# EAGLE design cartePIC+PCR95.8% 3 via+res (EAGLE 9.6.2)
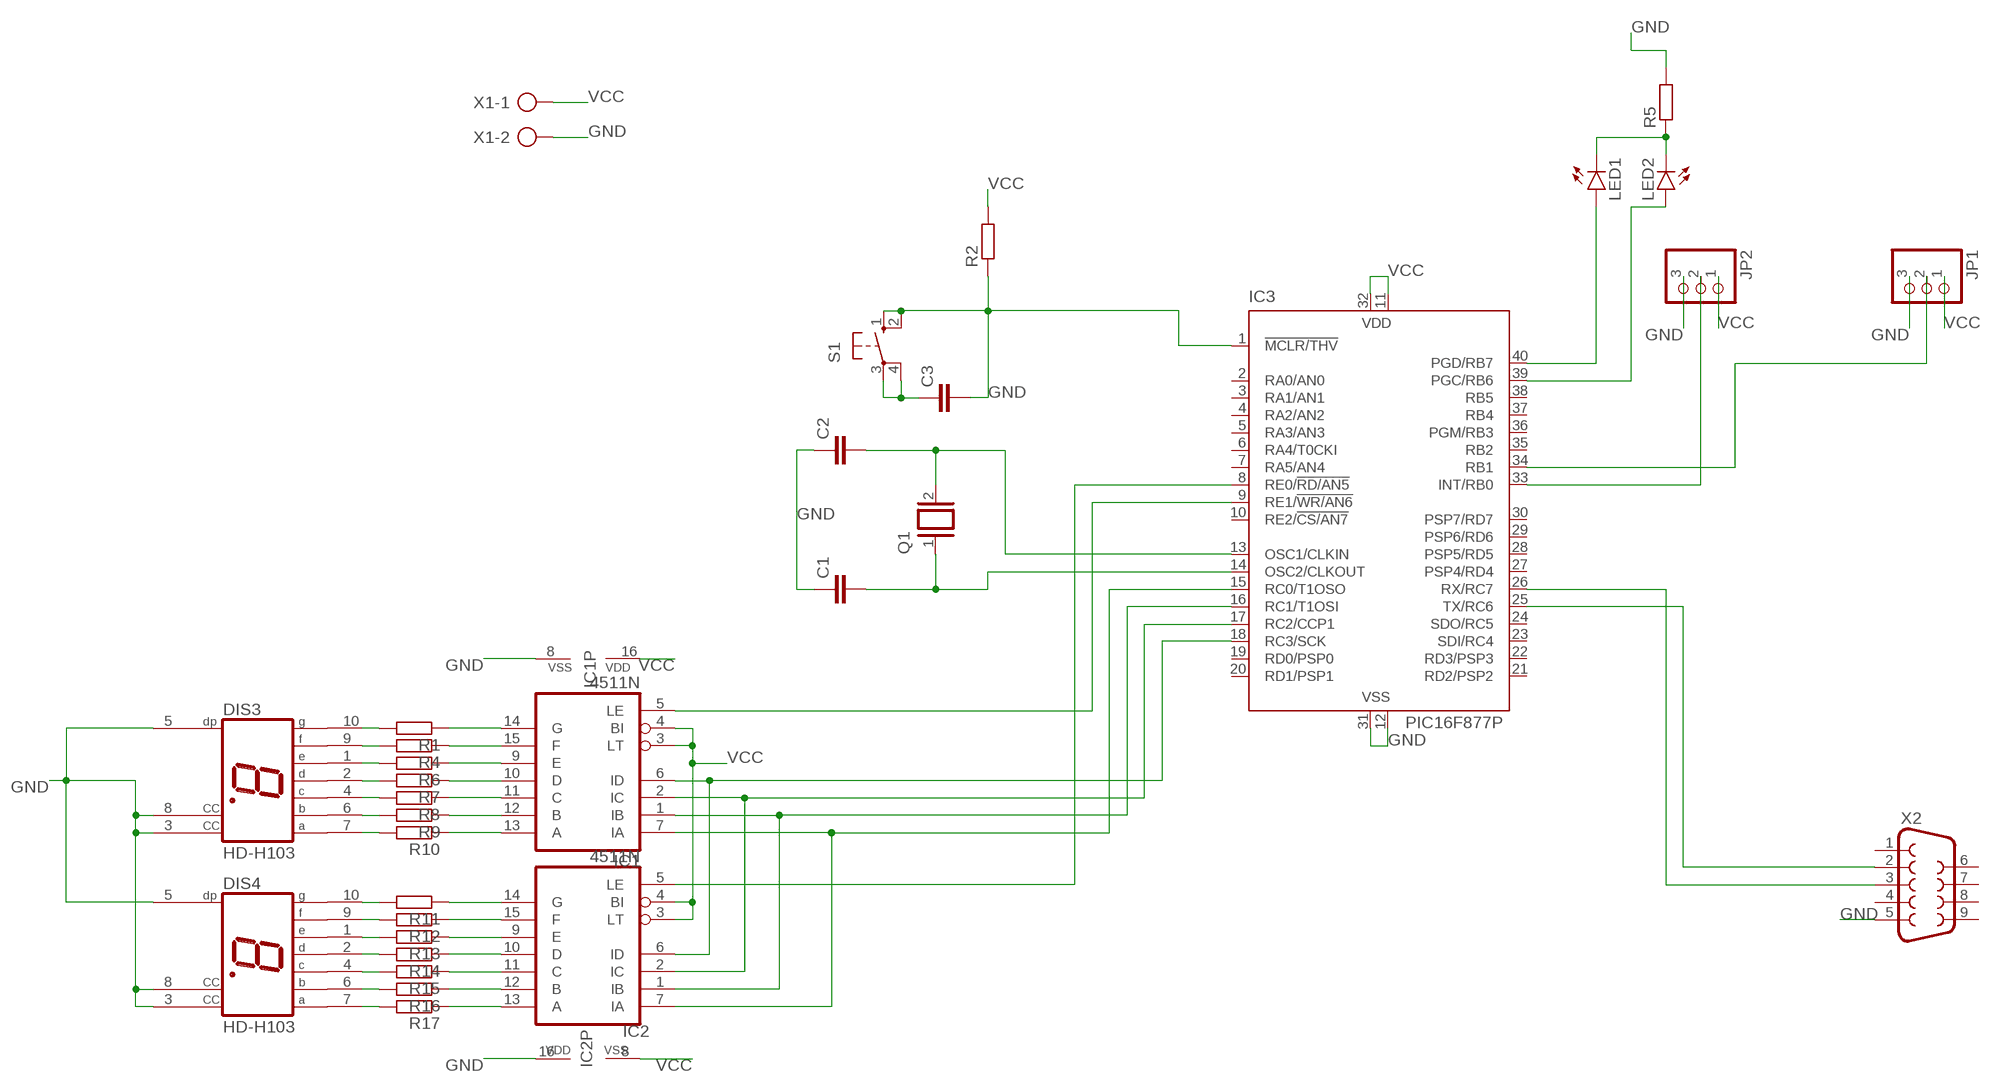
[diagram p0: schematic, sheet 1]

## Parts
C1  C-EU025-025X050  [C025-025X050]
C2  C-EU025-025X050  [C025-025X050]
C3  C-EU025-025X050  [C025-025X050]
DIS3  HD-H103  [HDSP-M]
DIS4  HD-H103  [HDSP-M]
IC1  4511N  [DIL16]
IC2  4511N  [DIL16]
IC3  PIC16F877P  [DIL40]
JP1  PINHD-1X3  [1X03]
JP2  PINHD-1X3  [1X03]
LED1  LED5MM  [LED5MM]
LED2  LED5MM  [LED5MM]
Q1  XTAL/S  [QS]
R1  R-EU_0207/10  [0207/10]
R2  R-EU_0207/10  [0207/10]
R4  R-EU_0207/10  [0207/10]
R5  R-EU_0207/10  [0207/10]
R6  R-EU_0207/10  [0207/10]
R7  R-EU_0207/10  [0207/10]
R8  R-EU_0207/10  [0207/10]
R9  R-EU_0207/10  [0207/10]
R10  R-EU_0207/10  [0207/10]
R11  R-EU_0207/10  [0207/10]
R12  R-EU_0207/10  [0207/10]
R13  R-EU_0207/10  [0207/10]
R14  R-EU_0207/10  [0207/10]
R15  R-EU_0207/10  [0207/10]
R16  R-EU_0207/10  [0207/10]
R17  R-EU_0207/10  [0207/10]
S1  10-XX  [B3F-10XX]
X1  AK300/2  [AK300/2]
X2  F09H  [F09H]

## Nets
GND: C1.1 C2.1 C3.2 DIS3.3(CC) DIS3.5(DP) DIS3.8(CC) DIS4.3(CC) DIS4.5(DP) DIS4.8(CC) IC1.8(VSS) IC2.16(VDD) IC3.1(!MCLR/THV) IC3.12(VSS) IC3.31(VSS) JP1.3 JP2.3 R2.1 R5.2 S1.1(S) S1.2(S1) X1.2 X2.5
N$1: IC1.5(LE) IC3.9(RE1/!WR/AN6)
N$2: IC2.5(LE) IC3.8(RE0/!RD/AN5)
N$3: IC1.6(ID) IC2.6(ID) IC3.18(RC3/SCK)
N$4: IC1.2(IC) IC2.2(IC) IC3.17(RC2/CCP1)
N$5: IC1.1(IB) IC2.1(IB) IC3.16(RC1/T1OSI)
N$6: IC1.7(IA) IC2.7(IA) IC3.15(RC0/T1OSO)
N$7: C2.2 IC3.13(OSC1/CLKIN) Q1.2
N$8: C1.2 IC3.14(OSC2/CLKOUT) Q1.1
N$9: IC1.14(G) R1.1
N$10: IC1.15(F) R4.1
N$11: IC1.9(E) R6.1
N$12: IC1.10(D) R7.1
N$13: IC1.11(C) R8.1
N$14: IC1.12(B) R9.1
N$15: IC1.13(A) R10.1
N$16: IC2.14(G) R11.1
N$17: IC2.15(F) R12.1
N$18: IC2.9(E) R13.1
N$19: IC2.10(D) R14.1
N$20: IC2.11(C) R15.1
N$21: IC2.12(B) R16.1
N$22: IC2.13(A) R17.1
N$24: IC3.33(INT/RB0) JP2.2
N$25: C3.1 S1.3(P) S1.4(P1)
N$26: IC3.34(RB1) JP1.2
N$27: IC3.40(PGD/RB7) LED1.A
N$28: IC3.25(TX/RC6) X2.2
N$29: IC3.26(RX/RC7) X2.3
N$30: IC3.39(PGC/RB6) LED2.A
N$31: LED1.K(C) LED2.K(C) R5.1
N$32: DIS3.10(G) R1.2
N$33: DIS3.9(F) R4.2
N$34: DIS3.1(E) R6.2
N$35: DIS3.2(D) R7.2
N$36: DIS3.4(C) R8.2
N$37: DIS3.6(B) R9.2
N$38: DIS3.7(A) R10.2
N$39: DIS4.10(G) R11.2
N$40: DIS4.9(F) R12.2
N$41: DIS4.1(E) R13.2
N$42: DIS4.2(D) R14.2
N$43: DIS4.4(C) R15.2
N$44: DIS4.6(B) R16.2
N$45: DIS4.7(A) R17.2
VCC: IC1.3(LT) IC1.4(BI) IC1.16(VDD) IC2.3(LT) IC2.4(BI) IC2.8(VSS) IC3.11(VDD) IC3.32(VDD) JP1.1 JP2.1 R2.2 X1.1
Unconnected: IC3.2(RA0/AN0) IC3.3(RA1/AN1) IC3.4(RA2/AN2) IC3.5(RA3/AN3) IC3.6(RA4/T0CKI) IC3.7(RA5/AN4) IC3.10(RE2/!CS/AN7) IC3.19(RD0/PSP0) IC3.20(RD1/PSP1) IC3.21(RD2/PSP2) IC3.22(RD3/PSP3) IC3.23(SDI/RC4) IC3.24(SDO/RC5) IC3.27(PSP4/RD4) IC3.28(PSP5/RD5) IC3.29(PSP6/RD6) IC3.30(PSP7/RD7) IC3.35(RB2) IC3.36(PGM/RB3) IC3.37(RB4) IC3.38(RB5) X2.1 X2.4 X2.6 X2.7 X2.8 X2.9

## Library data of the parts
C1-C3 = rcl:C-EU: CAPACITOR, European symbol; SPICEPREFIX: C
DIS3 DIS4 = display-hp:HD-H103: LED DISPLAY 1-character 7 segment, decimal point right; OC_FARNELL: unknown; OC_NEWARK: unknown
IC1 IC2 = 45xx:4511: BCD to 7-segment LATCH/DECODER/DRIVER
IC3 = microchip:PIC16F87*: MICROCONTROLLER; MF: MICROCHIP; MPN: PIC16F877-04/P; OC_FARNELL: 9761349; OC_NEWARK: 61K3463
JP1 JP2 = pinhead:PINHD-1X3: PIN HEADER
LED1 LED2 = led:LED: LED OSRAM: - CHIPLED LG R971, LG N971, LY N971, LG Q971, LY Q971, LO R971, LY R971 LH N974, LH R974 LS Q976, LO Q976, LY Q976 LO Q996 - Hyper CHIPLED LW Q18S LB Q993, LB Q99A, LB R99A - SideLED LS A670, LO A670, LY A670, LG A670, LP A670 LB A673, LV A673, LT A673, LW A673 LH A674 LY A675 LS A676, LA A676, LO A676, LY A676, LW A676 LS A679, LY A679, LG A679 - Hyper Micro SIDELED® LS Y876, LA Y876, LO Y876, LY Y876 LT Y87S - SmartLED LW L88C, LW L88S LB L89C, LB L89S, LG L890 LS L89K, LO L89K, LY L89K LS L896, LA L896, LO L896, LY L896 - TOPLED LS T670, LO T670, LY T670, LG T670, LP T670 LSG T670, LSP T670, LSY T670, LOP T670, LYG T670 LG T671, LOG T671, LSG T671 LB T673, LV T673, LT T673, LW T673 LH T674 LS T676, LA T676, LO T676, LY T676, LB T676, LH T676, LSB T676, LW T676 LB T67C, LV T67C, LT T67C, LS T67K, LO T67K, LY T67K, LW E67C LS E67B, LA E67B, LO E67B, LY E67B, LB E67C, LV E67C, LT E67C LW T67C LS T679, LY T679, LG T679 LS T770, LO T770, LY T770, LG T770, LP T770 LB T773, LV T773, LT T773, LW T773 LH T774 LS E675, LA E675, LY E675, LS T675 LS T776, LA T776, LO T776, LY T776, LB T776 LHGB T686 LT T68C, LB T68C - Hyper Mini TOPLED® LB M676 - Mini TOPLED Santana® LG M470 LS M47K, LO M47K, LY M47K Source: http://www.osram.convergy.de LUXEON: - LUMILED® LXK2-PW12-R00, LXK2-PW12-S00, LXK2-PW14-U00, LXK2-PW14-V00 LXK2-PM12-R00, LXK2-PM12-S00, LXK2-PM14-U00 LXK2-PE12-Q00, LXK2-PE12-R00, LXK2-PE12-S00, LXK2-PE14-T00, LXK2-PE14-U00 LXK2-PB12-K00, LXK2-PB12-L00, LXK2-PB12-M00, LXK2-PB14-N00, LXK2-PB14-P00, LXK2-PB14-Q00 LXK2-PR12-L00, LXK2-PR12-M00, LXK2-PR14-Q00, LXK2-PR14-R00 LXK2-PD12-Q00, LXK2-PD12-R00, LXK2-PD12-S00 LXK2-PH12-R00, LXK2-PH12-S00 LXK2-PL12-P00, LXK2-PL12-Q00, LXK2-PL12-R00 Source: www.luxeon.com KINGBRIGHT: KA-3528ASYC Source: www.kingbright.com
Q1 = special:XTAL/S: CRYSTAL
R1 R2 R4-R17 = rcl:R-EU_: RESISTOR, European symbol; SPICEPREFIX: R
S1 = switch-omron:10-XX: OMRON SWITCH; MPN: B3F-1000; OC_FARNELL: 176432; OC_NEWARK: 36M3542
X1 = con-ptr500:AK300/2: CONNECTOR; OC_FARNELL: unknown; OC_NEWARK: unknown
X2 = con-subd:F09: SUB-D; OC_FARNELL: unknown; OC_NEWARK: unknown

## Board
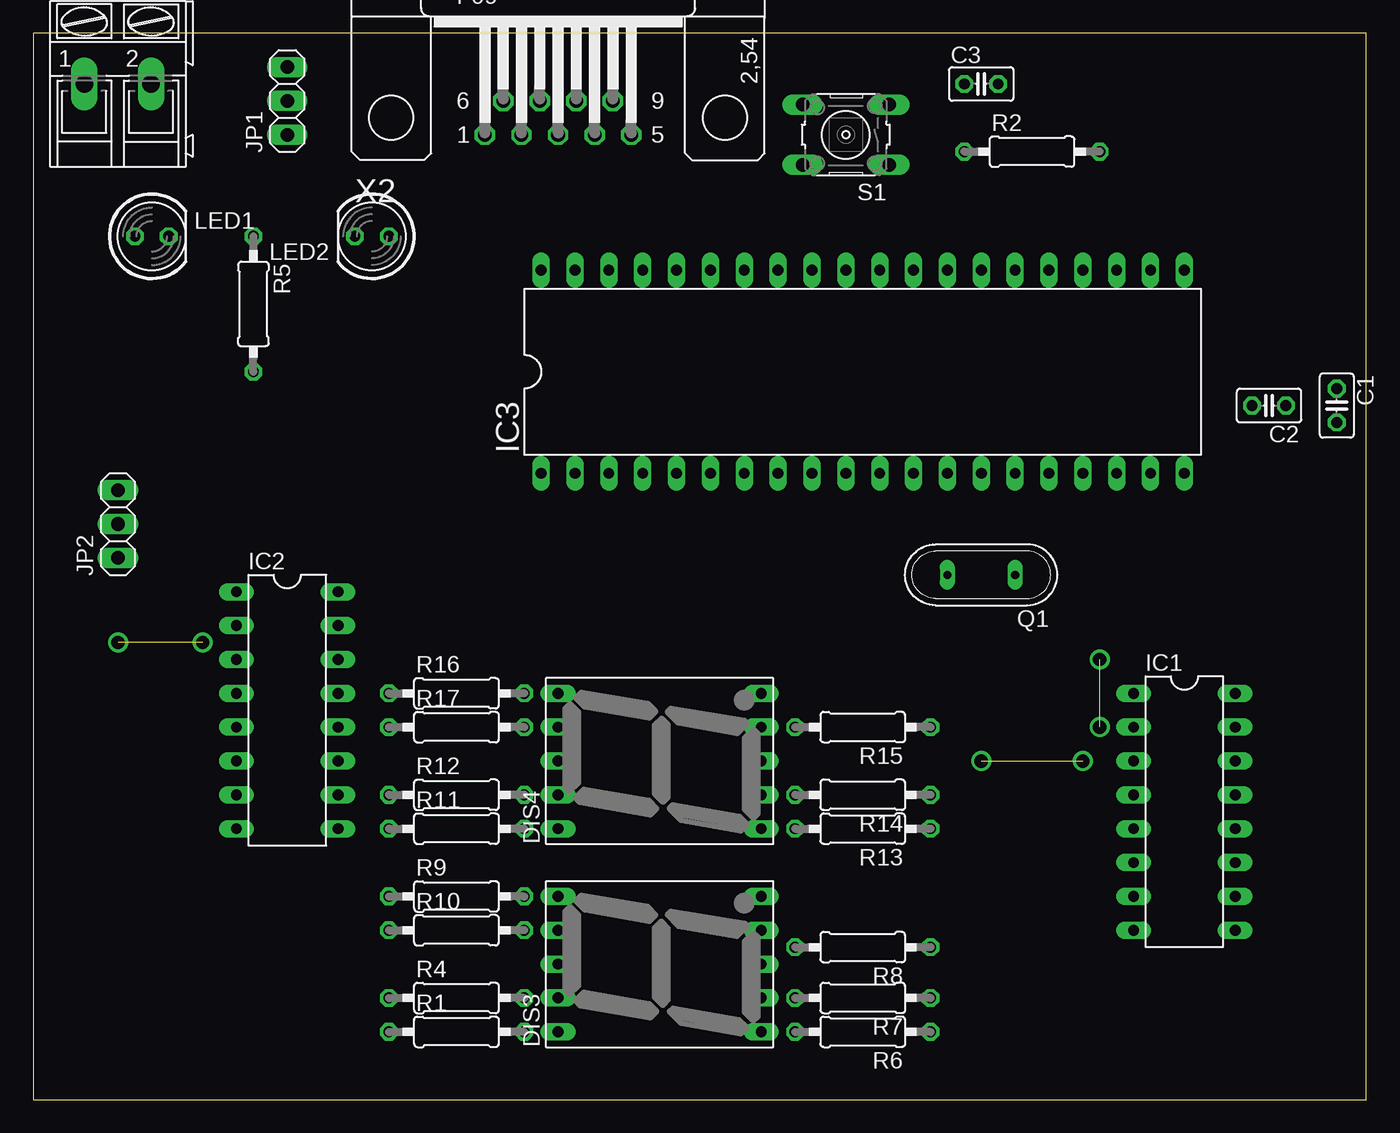
[diagram p1: board, top side]
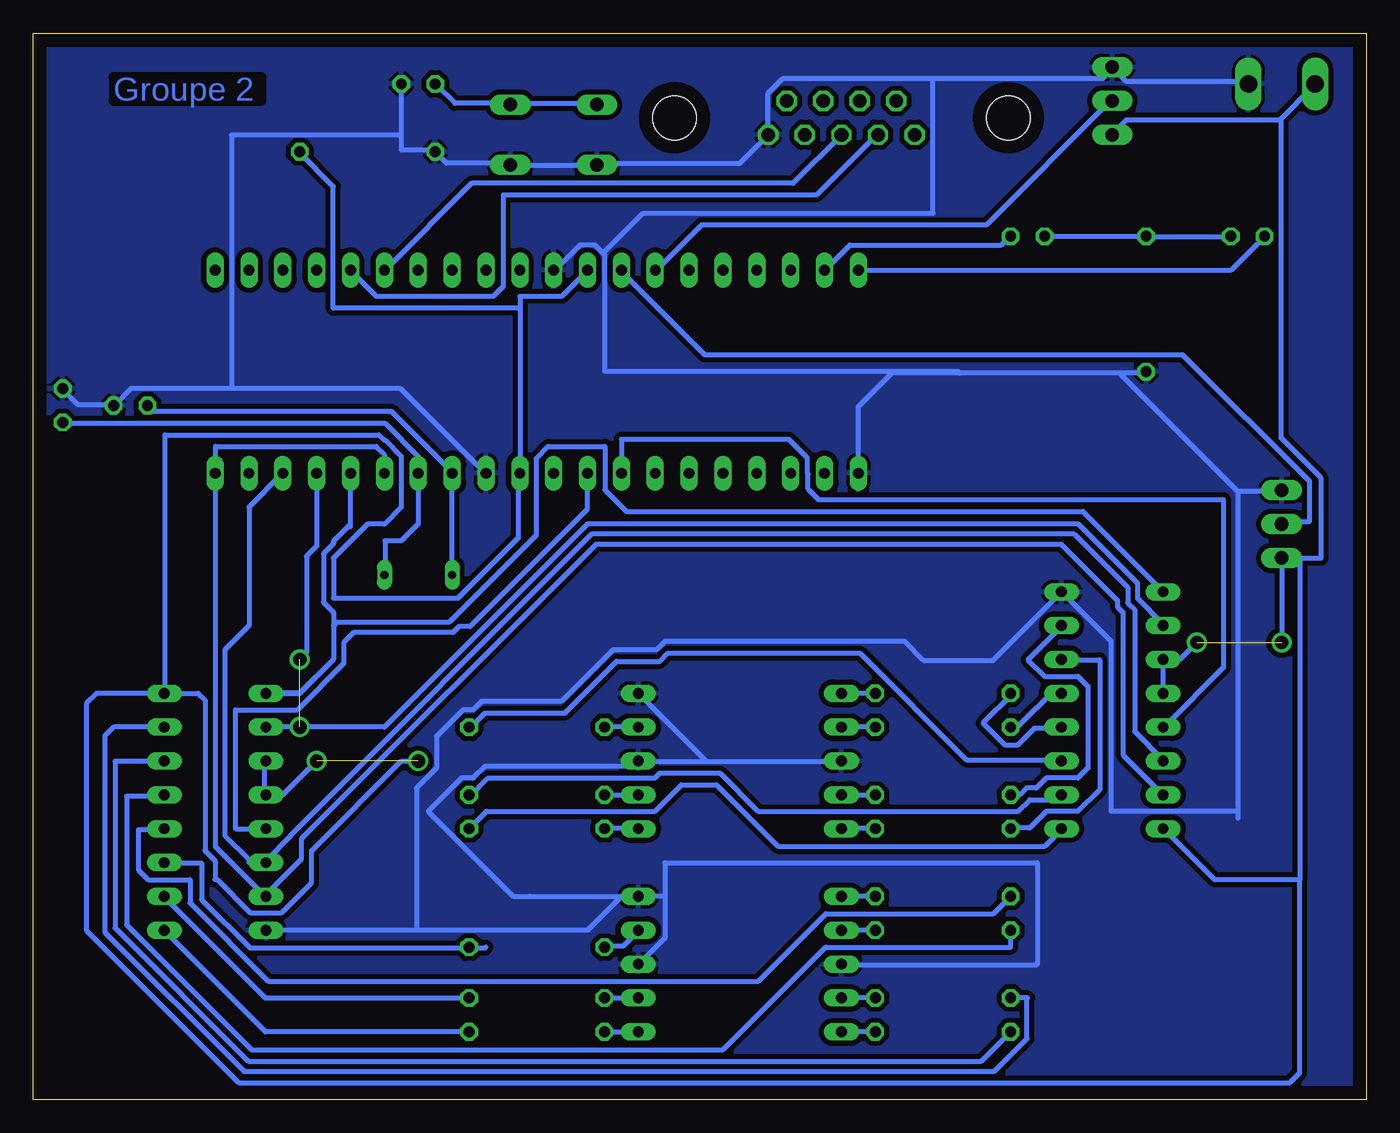
[diagram p2: board, bottom side, seen from below]

Size 100 x 80 mm. Coordinates in mm from the lower left corner, seen from the top.
Outline: 0,0 100,0 100,80 0,80 0,0
Copper layers (1*16): Top 0.035mm / dielectric 1.5mm / Bottom 0.035mm
Design rules "default *": minimum track width 15mil, minimum drill 0.35mm, track to track 15mil, track to pad 15mil, pad to pad 15mil, via to via 15mil, smd to smd 6mil, copper to edge 40mil, drill to drill 6mil, minimum pad ring 10mil, minimum via ring 8mil, stop-mask expansion 4mil, vias tented up to drill 0mil, thermal gap 10mil

### Footprints (pad centres in the part's own frame; a part is rotated, then mirrored left to right if it is on the bottom)
C025-025X050 = drill 0.813 octagon: 1 -1.27,0; 2 1.27,0
HDSP-M = drill 0.813 long: 1 -5.08,-7.62; 2 -2.54,-7.62; 3 0,-7.62; 4 2.54,-7.62; 5 5.08,-7.62; 6 5.08,7.62; 7 2.54,7.62; 8 0,7.62; 9 -2.54,7.62; 10 -5.08,7.62
DIL16 = drill 0.813 long: 1 -8.89,-3.81; 2 -6.35,-3.81; 3 -3.81,-3.81; 4 -1.27,-3.81; 5 1.27,-3.81; 6 3.81,-3.81; 7 6.35,-3.81; 8 8.89,-3.81; 9 8.89,3.81; 10 6.35,3.81; 11 3.81,3.81; 12 1.27,3.81; 13 -1.27,3.81; 14 -3.81,3.81; 15 -6.35,3.81; 16 -8.89,3.81
DIL40 = drill 0.813 long: 1 -24.13,-7.62; 2 -21.59,-7.62; 3 -19.05,-7.62; 4 -16.51,-7.62; 5 -13.97,-7.62; 6 -11.43,-7.62; 7 -8.89,-7.62; 8 -6.35,-7.62; 9 -3.81,-7.62; 10 -1.27,-7.62; 11 1.27,-7.62; 12 3.81,-7.62; 13 6.35,-7.62; 14 8.89,-7.62; 15 11.43,-7.62; 16 13.97,-7.62; 17 16.51,-7.62; 18 19.05,-7.62; 19 21.59,-7.62; 20 24.13,-7.62; 21 24.13,7.62; 22 21.59,7.62; 23 19.05,7.62; 24 16.51,7.62; 25 13.97,7.62; 26 11.43,7.62; 27 8.89,7.62; 28 6.35,7.62; 29 3.81,7.62; 30 1.27,7.62; 31 -1.27,7.62; 32 -3.81,7.62; 33 -6.35,7.62; 34 -8.89,7.62; 35 -11.43,7.62; 36 -13.97,7.62; 37 -16.51,7.62; 38 -19.05,7.62; 39 -21.59,7.62; 40 -24.13,7.62
1X03 = drill 1.016 long: 1 -2.54,0; 2 0,0; 3 2.54,0
LED5MM = drill 0.813 octagon: A -1.27,0; K 1.27,0
QS = drill 0.61 long: 1 -2.54,0; 2 2.54,0
0207/10 = drill 0.813 octagon: 1 -5.08,0; 2 5.08,0
B3F-10XX = drill 1.016 long: 1 -3.251,2.261; 2 3.251,2.261; 3 -3.251,-2.261; 4 3.251,-2.261
AK300/2 = drill 1.321 long: 1 -2.515,0; 2 2.489,0
F09H = drill 1.016 octagon: 1 -5.486,-1.27; 2 -2.743,-1.27; 3 0,-1.27; 4 2.743,-1.27; 5 5.486,-1.27; 6 -4.115,1.27; 7 -1.372,1.27; 8 1.372,1.27; 9 4.115,1.27 | hole 3.302: -12.522,0; 12.522,0

### Placement (x,y rotation side)
C1  97.79,52.07 270 top
C2  92.71,52.07 180 top
C3  71.12,76.2 0 top
DIS3  46.99,10.16 90 top
DIS4  46.99,25.4 90 top
IC1  86.36,21.59 270 top
IC2  19.05,29.21 270 top
IC3  62.23,54.61 0 top
JP1  19.05,74.93 90 top
JP2  6.35,43.18 90 top
LED1  8.89,64.77 0 top
LED2  25.4,64.77 180 top
Q1  71.12,39.37 180 top
R1  31.75,5.08 0 top
R2  74.93,71.12 0 top
R4  31.75,7.62 0 top
R5  16.51,59.69 270 top
R6  62.23,5.08 180 top
R7  62.23,7.62 180 top
R8  62.23,11.43 180 top
R9  31.75,15.24 0 top
R10  31.75,12.7 0 top
R11  31.75,20.32 0 top
R12  31.75,22.86 0 top
R13  62.23,20.32 180 top
R14  62.23,22.86 180 top
R15  62.23,27.94 180 top
R16  31.75,30.48 0 top
R17  31.75,27.94 0 top
S1  60.96,72.39 180 top
X1  6.35,76.2 0 top
X2  39.37,73.66 0 top

### Tracks (layer width: path | path; a pad name or v marks a point on that pad's centre or on a via)
GND
  Bottom 0.381: 19,77.38 JP1.3 | 8.88,76.25 X1.2 | 19.12,77.25 JP1.3 | 8.75,76.12 X1.2 | 85.12,53.38 92.62,53.38 93.88,52.12 C2.1 94.12,52.12 96.62,52.12 97.75,53.25 C1.1 | 85.12,53.38 72.5,53.38 66.12,47 IC3.12 | JP1.3 18.88,77.25 18,76.38 9,76.38 X1.2 | 72.38,72.38 72.38,71.25 69.88,71.25 R2.1 69.75,71 69,70.25 64.25,70.25 S1.1 64.12,70.12 57.75,70.12 S1.2 57.62,70.25 47,70.25 44.88,72.38 X2.5 44.88,72.5 44.88,75.5 43.75,76.62 32.5,76.62 | 72.38,72.38 72.38,76.12 C3.2 | 32.5,76.62 19.75,76.62 19.25,77.12 JP1.3 | 85.12,53.38 85.12,72.38 72.38,72.38 | 55.88,15.24 58.42,12.7 71.25,12.7 | 71.25,12.7 IC1.8 | 9.62,45.62 9.62,21.62 | 9.62,21.62 9.62,21.12 | 9.62,45.62 6.38,45.62 JP2.3 | 9.62,21.62 19.12,21.62 19.12,34.38 22.75,38 IC2.16 28.04,32.92 33.15,32.92 33.25,33 34.62,34.38 52.62,34.38 53.25,33.75 56.5,33.75 60.38,29.88 66.38,29.88 67,29.25 67.75,29.25 69.75,27.25 69.75,24.88 71.25,23.38 71.25,12.7 | IC3.1 38.1,51.98 35.58,54.5 30.5,54.5 | 18.38,54.5 16.62,54.5 R5.2 | 18.38,54.5 30.5,54.5 | 57.25,63.5 57.12,63.38 57.12,54.62 30.62,54.62 30.5,54.5 | 57.25,63.5 57.88,64.12 59,64.12 60.88,62.25 IC3.31 | 9.62,45.62 18.38,54.38 18.38,54.5 | 32.5,76.62 32.5,66.5 54.25,66.5 57.25,63.5 | DIS3.8 39.37,10.12 24.67,10.12 24.67,17.77 52.62,17.77 52.62,15.25 | 52.62,15.25 52.62,12.12 54.49,10.25 DIS3.3 | 52.62,15.25 54.49,15.25 DIS3.5 62.58,15.24 62.74,15.25 64,15.25 70.38,21.62 67.88,24.12 67,24.12 66.12,25 55.12,25 54.75,25.38 DIS4.3 54.5,25.38 49.62,25.38 | 49.62,25.38 39.38,25.38 DIS4.8 | DIS4.5 54.5,30.38 49.62,25.5 49.62,25.38
  pour Bottom: 0,0 0,80.01 100.33,80.01 100.33,0
N$1
  Bottom 0.381: IC1.5 84.83,20.32 84.83,29.25 80.18,29.25 76.72,32.71 76.72,34.29 75.97,35.04 68.51,35.04 68.06,35.49 67.24,35.49 58.42,44.31 IC3.9
N$2
  Bottom 0.381: IC2.5 15.12,28 10.71,32.41 10.71,45 41.05,45 41.87,45.82 41.87,46.91 41.95,46.99 41.95,48.16 43.32,49.53 55.88,49.53 55.88,46.88 IC3.8
N$3
  Bottom 0.381: IC2.6 15.25,25.5 17.38,27.62 17.38,36.76 17.89,37.27 17.89,38.41 21.91,42.42 58.1,42.42 80.66,19.86 80.66,19.81 82.55,17.92 IC1.6 82.5,17.88 82.59,17.78 83.82,17.78 83.82,17.97 85.59,19.75 85.59,33.79 83.82,35.56 83.82,44.45 IC3.18
N$4  (via drill 1 pad 1.3)  (1 unrouted)
  Bottom 0.381: IC1.2 v80.01,27.94 73.66,27.94 58.42,43.18 21.59,43.18 17.13,38.72 17.13,37.59 15.24,35.7 IC2.2 | IC3.17 78.74,41.52 79.5,40.76 79.5,33.53 v80.01,33.02
N$5
  Bottom 0.381: IC2.1 15.25,38.12 21.25,44.12 55.5,44.12 57.12,45.75 57.12,49 61.38,49 61.38,48.98 62.25,48.1 62.25,42.38 68.82,35.8 77.23,35.8 77.48,35.55 | 78.74,31.75 80.01,30.48 IC1.1 82.38,30.5 80.01,30.5 77.48,33.03 77.48,35.55 | 76.2,42.99 76.2,43.18 | 76.2,43.18 IC3.16 | 76.2,43.18 77.48,41.9 77.48,41.71 78.23,40.96 78.23,37.31 77.48,36.56 77.48,35.55
N$6
  Bottom 0.381: IC2.7 15.25,22.88 18.25,25.88 18.25,36.55 18.66,36.96 18.66,37.45 22.86,41.66 57.79,41.66 79.9,19.55 79.9,18.03 82.55,15.38 IC1.7 82.62,15.25 86.36,18.98 86.36,49 74.27,49 73.66,48.39 IC3.15
N$7
  Bottom 0.381: Q1.2 68.62,39.38 68.62,46.88 IC3.13 68.62,47.12 73.12,51.62 91,51.62 91.38,52 C2.2
N$8
  Bottom 0.381: Q1.1 73.62,39.38 73.62,41.91 72.39,41.91 71.12,43.18 IC3.14 71.12,48.26 73.61,50.75 97.75,50.75 C1.2
N$9
  Bottom 0.381: IC1.14 90.25,25.38 93.88,25.38 93.88,12.88 83.88,2.88 28.88,2.88 R1.1
N$10
  Bottom 0.381: IC1.15 93.98,27.94 94.64,27.28 94.64,12.56 84.22,2.14 84.19,2.11 27.89,2.11 25.44,4.57 25.44,7.58 25.4,7.62 R4.1
N$11
  Bottom 0.381: IC1.9 90.12,12.62 82.58,5.08 R6.1
N$12
  Bottom 0.381: IC1.10 90.12,15.12 82.62,7.62 R7.1
N$13
  Bottom 0.381: IC1.11 90.12,17.75 87.38,17.75 87.38,15 83.75,11.38 67.37,11.38 | 67.37,11.38 66.09,11.38 66.04,11.43 | R8.1 67.37,11.5 67.37,11.38
N$14
  Bottom 0.381: IC1.12 90.25,20.25 92.12,20.25 92.12,17.25 91.38,16.5 88.25,16.5 88.25,14.75 82.38,8.88 45.6,8.88 40.54,13.93 27.98,13.93 R9.1
N$15
  Bottom 0.381: IC1.13 90.25,22.75 93,22.75 93,13.12 83.62,3.75 48.24,3.75 40.56,11.43 26.67,11.43 R10.1
N$16
  Bottom 0.381: IC2.14 22.75,33 20,33 20,23.25 21.62,21.62 24,21.62 25.25,20.38 26.62,20.38 R11.1
N$17
  Bottom 0.381: 22.88,35.5 IC2.15 23,35.38 25.38,33 24.12,31.75 21.62,31.75 20.88,31 20.88,24.88 21.62,24.12 24,24.12 24.75,23.38 25.5,23.38 26,22.88 26.62,22.88 R12.1
N$18
  Bottom 0.381: IC2.9 22.88,20.25 24.12,19 44.12,19 48.75,23.62 51.38,23.62 53.38,21.62 66,21.62 67.25,20.38 R13.1
N$19
  Bottom 0.381: 23.12,22.5 22.88,22.75 IC2.10 23.25,22.5 25.25,22.5 26.12,21.62 45.62,21.62 48.5,24.5 53,24.5 53.38,24.12 65.88,24.12 67.25,22.75 R14.1
N$20
  Bottom 0.381: IC2.11 22.88,25.5 30,25.5 38,33.5 52.38,33.5 53,32.88 56.25,32.88 60.12,29 66.12,29 67.25,27.88 R15.1
N$21
  Bottom 0.381: 22.88,28 IC2.12 23,27.88 24.88,27.88 26.12,26.62 27.12,26.62 28.75,28.25 26.62,30.38 R16.1
N$22
  Bottom 0.381: 23.25,30.88 22.88,30.5 IC2.13 23.38,30.75 26.12,28 26.62,28 R17.1
N$24
  Bottom 0.381: 6.38,43.25 JP2.2 6.25,43.38 4.25,43.38 4.25,46.38 13.75,55.88 49.62,55.88 55.88,62.12 IC3.33
N$25
  Bottom 0.381: C3.1 69.75,76.12 68.38,74.75 64.25,74.75 S1.3 64.12,74.75 57.75,74.75 S1.4
N$26
  Bottom 0.381: 19,75 JP1.2 19.12,74.75 19.38,74.75 28.5,65.62 49.88,65.62 53.25,62.25 IC3.34
N$27
  Bottom 0.381: LED1.A 7.62,64.75 10.12,62.25 38,62.25 IC3.40
N$28
  Bottom 0.381: IC3.25 76.12,62.12 74.25,60.25 65.5,60.25 64.75,61 64.75,67.88 41.25,67.88 36.75,72.38 X2.2
N$29
  Bottom 0.381: IC3.26 73.62,62.25 67.12,68.75 43,68.75 39.38,72.38 X2.3
N$30
  Bottom 0.381: LED2.A 26.75,64.75 27.38,64.12 38.75,64.12 40.62,62.25 IC3.39
N$31
  Bottom 0.381: LED1.K 10.25,64.75 16.5,64.75 R5.1 16.62,64.75 24.12,64.75 LED2.K
N$32
  Bottom 0.381: R1.2 DIS3.10
N$33
  Bottom 0.381: R4.2 DIS3.9
N$34
  Bottom 0.381: R6.2 DIS3.1
N$35
  Bottom 0.381: DIS3.2 57.12,7.62 R7.2
N$36
  Bottom 0.381: R8.2 57.12,11.5 55.74,11.5 54.62,12.62 DIS3.4
N$37
  Bottom 0.381: R9.2 DIS3.6
N$38
  Bottom 0.381: R10.2 DIS3.7
N$39
  Bottom 0.381: R11.2 36.88,20.38 39.25,20.38 DIS4.10
N$40
  Bottom 0.381: R12.2 36.88,22.88 39.25,22.88 DIS4.9
N$41
  Bottom 0.381: DIS4.1 54.62,20.38 57.12,20.38 R13.2
N$42
  Bottom 0.381: DIS4.2 54.62,22.88 57.12,22.88 R14.2
N$43
  Bottom 0.381: DIS4.4 54.62,28 57.12,28 R15.2
N$44
  Bottom 0.381: R16.2 36.88,30.5 39.25,30.5 DIS4.6
N$45
  Bottom 0.381: R17.2 36.88,28 39.25,28 DIS4.7
VCC  (via drill 1 pad 1.3)  (2 unrouted)
  Bottom 0.381: 6.38,40.62 JP2.1 | 3.88,76.12 X1.1 4,76 6.5,73.5 | 6.5,73.5 18,73.5 19,72.5 JP1.1 | 5,16.5 11.38,16.5 15.12,20.25 IC2.8 | JP2.1 6.25,40.5 5,40.5 5,16.5 | 6.5,73.5 6.38,73.38 6.38,49.62 3.38,46.62 3.38,40.62 4.88,40.62 JP2.1 | 63.5,59.38 63.5,60.25 60.38,60.25 58.5,62.12 IC3.32 | 63.5,59.38 IC3.11 63.62,46.88 63.62,42.12 68.12,37.62 77.47,37.62 77.47,40.64 74.93,43.18 73.66,43.18 72.39,44.45 72.39,48.26 73.6,49.47 73.66,49.47 74.07,49.88 90.12,49.88 90.12,30.5 IC1.16 | 63.5,59.38 77.5,59.38 77.5,68.5 80,71 R2.2 | 5,16.5 5,15.24 5,2 5.73,1.27 84.59,1.27 96.02,12.7 96.02,29.71 95.25,30.48 IC1.16 | IC2.4 IC2.3 13.97,33.02 v12.7,34.29 | IC1.3 82.68,25.15 82.68,22.86 IC1.4 81.28,22.86 v78.74,25.4 | IC1.16 87.63,30.48 87.12,29.97 87.12,18.66 86.36,17.91 86.36,16.51 86.22,16.51 83.72,14.01 81.38,14.01 79.13,16.25 79.13,18.66 72.39,25.4 v71.12,25.4 | JP2.1 v6.35,34.29

### Text on the board
Bottom: Groupe 2